# Altium schematic sheet Digital_Input.SchDoc
size A3 portrait
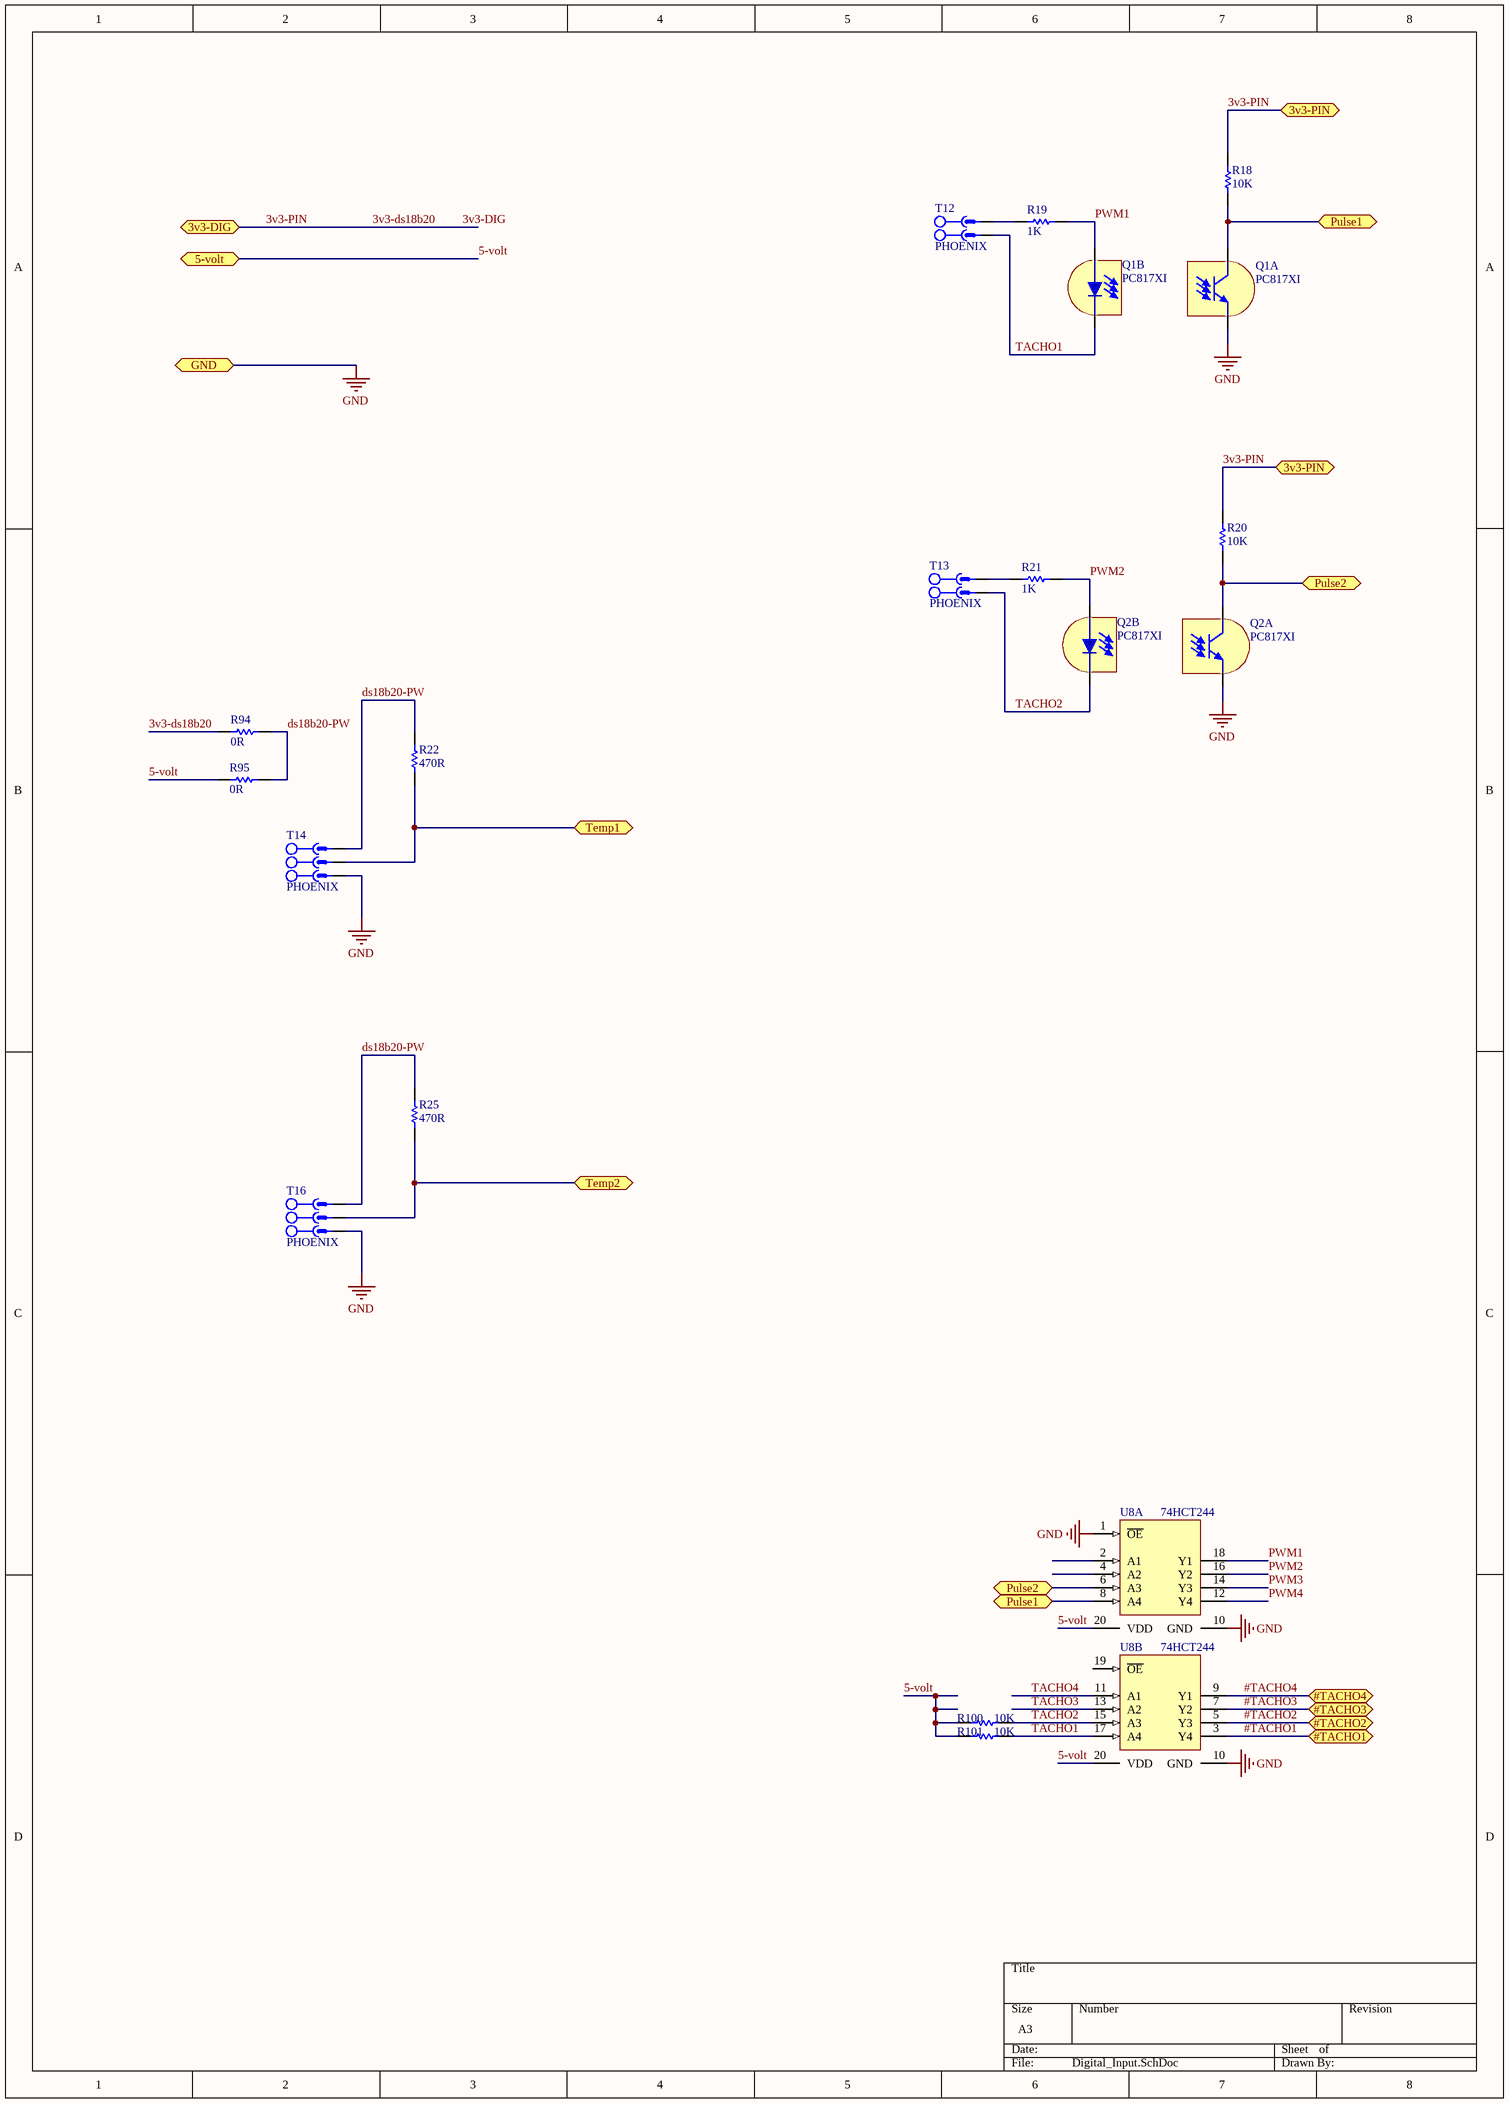
[diagram p0: Digital_Input.SchDoc]

## Parts
Q1  PC817XI  [SMT Gullwing Lead-Form]  (parts A,B of 2)
Q2  PC817XI  [SMT Gullwing Lead-Form]  (parts A,B of 2)
R18  10K  [RESC3413X04N]
R19  1K  [RESC3413X04N]
R20  10K  [RESC3413X04N]
R21  1K  [RESC3413X04N]
R22  470R  [RESC3413X04N]
R25  470R  [RESC3413X04N]
R94  0R  [0805_R]
R95  0R  [0805_R]
R100  10K  [RESC3413X04N]
R101  10K  [RESC3413X04N]
T12  PHOENIX  [MSTB 2,5/2-G-5,08]
T13  PHOENIX  [MSTB 2,5/2-G-5,08]
T14  PHOENIX  [MSTB 2,5/3-G-5,08]
T16  PHOENIX  [MSTB 2,5/3-G-5,08]
U8  74HCT244  [SSOP20_M]  (parts A,B of 2)

## Ports
3v3-DIG (bidir), 3v3-PIN (bidir), 5-volt (bidir), #TACHO1 (bidir), #TACHO2 (bidir), #TACHO3 (bidir), #TACHO4 (bidir), GND (bidir), Pulse1 (bidir), Pulse2 (bidir), Temp1 (bidir), Temp2 (bidir)

## Nets
GND: Q1.3(E) Q2.3(E) T14.1 T16.1 U8.1(~{OE}) U8.10(GND) ; port GND
3v3-DIG: R18.2 R20.2 R94.2 ; port 3v3-PIN, port 3v3-DIG  [also labelled 3v3-ds18b20, 3v3-PIN]
5-volt: R95.2 R100.2 R101.2 U8.20(VDD) ; port 5-volt
#TACHO1: U8.3(Y4) ; port #TACHO1
#TACHO2: U8.5(Y3) ; port #TACHO2
#TACHO3: U8.7(Y2) ; port #TACHO3
#TACHO4: U8.9(Y1) ; port #TACHO4
ds18b20-PW: R22.2 R25.2 R94.1 R95.1 T14.3 T16.3
Pulse1: Q1.4(C) R18.1 U8.8(A4) ; port Pulse1
Pulse2: Q2.4(C) R20.1 U8.6(A3) ; port Pulse2
PWM1: Q1.1(A) R19.2 U8.18(Y1)
PWM2: Q2.1(A) R21.2 U8.16(Y2)
PWM3: U8.14(Y3)
PWM4: U8.12(Y4)
TACHO1: Q1.2(K) R101.1 T12.1 U8.17(A4)
TACHO2: Q2.2(K) R100.1 T13.1 U8.15(A3)
TACHO3: U8.13(A2)
TACHO4: U8.11(A1)
Temp1: R22.1 T14.2 ; port Temp1
Temp2: R25.1 T16.2 ; port Temp2
NetR19_1: R19.1 T12.2
NetR21_1: R21.1 T13.2

Not connected (* = marked no-connect by the designer): U8 2(A1) 4(A2) 19(~{OE})

## Library data of the parts
Q1 Q2 = PC817XI: DIP 4pin General Purpose  Photocoupler; Published: 2017-2-27; DatasheetVersion: 2017-2-27; PackageVersion: 2017-2-27; PackageReference: SMT Gullwing Lead-Form; Publisher: Abbas Basereh; PackageDescription: SOP, 4-Leads, Body 4/65x6/75mm, Pitch 2/54mm, IPC Medium Density designer:abbas basereh; ComponentLink1Description: Manufacturer Link; ComponentLink1URL: http://www.roboeq.ir/files/id/233/name/PC817.pdf/; ComponentLink2Description: DIP 4pin General Purpose
R18-R22 R25 R94 R95 R100 R101 = RES 0805 0.125W: RES 0805; Designer: Abbas Basereh; Desc.: RES SMD 0805; Data: 16-12-2016
T12 T13 = CON_Phoenix_MSTB_02: 2 Pitch: 5.08 mm Color: green Contact surface: Tin Assembly; Manufacturer: PHOENIX CONTACT; Connector type: PCB Terminal Block; designer: ABBAS BASEREH; Max Current: 12 A; Positions: 2; Voltage: 320 V; Category: Connector; ComponentLink1Description: Header, Nominal current: 12 A Rated voltage (III/2): 320 V Number of positions: 2 Pitch: 5.08 mm Color: green Contact surface: Tin Assembly: Soldering  DESIGNER:ABBAS BASEREH; ComponentLink2Description: Reference; Mounting Technology: Through-Hole; Pin Count: 2; Revision 1: 2017-3-1; Status: Unreleased; PART.NO: PHOENIX
T14 T16 = CON_Phoenix_MSTB_03: 3 Pitch: 5.08 mm Color: green Contact surface: Tin Assembly; Manufacturer: PHOENIX CONTACT; Connector type: PCB Terminal Block; designer: ABBAS BASEREH; Max Current: 12 A; Positions: 3; Voltage: 320 V; Category: Connector; ComponentLink1Description: Header, Nominal current: 12 A Rated voltage (III/2): 320 V Number of positions: 3 Pitch: 5.08 mm Color: green Contact surface: Tin Assembly: Soldering  DESIGNER:ABBAS BASEREH; ComponentLink2Description: Reference; Mounting Technology: Through-Hole; Pin Count: 3; Revision 1: 2017-3-1; Status: Unreleased; PART.NO: PHOENIX
U8 = MC74HC244AN: Octal 3-State Non-Inverting Buffer/Line Driver/Line Receiver; Published: 15-Apr-2002; DatasheetVersion: Mar-2000; PackageVersion: 1996; PackageReference: 738-03; Publisher: Altium Limited; PackageDescription: DIP; 20 Leads; Row Spacing 7.62 mm; Pitch 2.54 mm; Code_JEDEC: MS-001-AD; ComponentLink1Description: Manufacturer Link; ComponentLink1URL: http://www.onsemi.com/; ComponentLink2Description: Datasheet; ComponentLink2URL: http://www.onsemi.com/pub/Collateral/MC74HC244A-D.PDF